# EAGLE design WMF Ambient SmartPot_C (EAGLE 9.5.1)
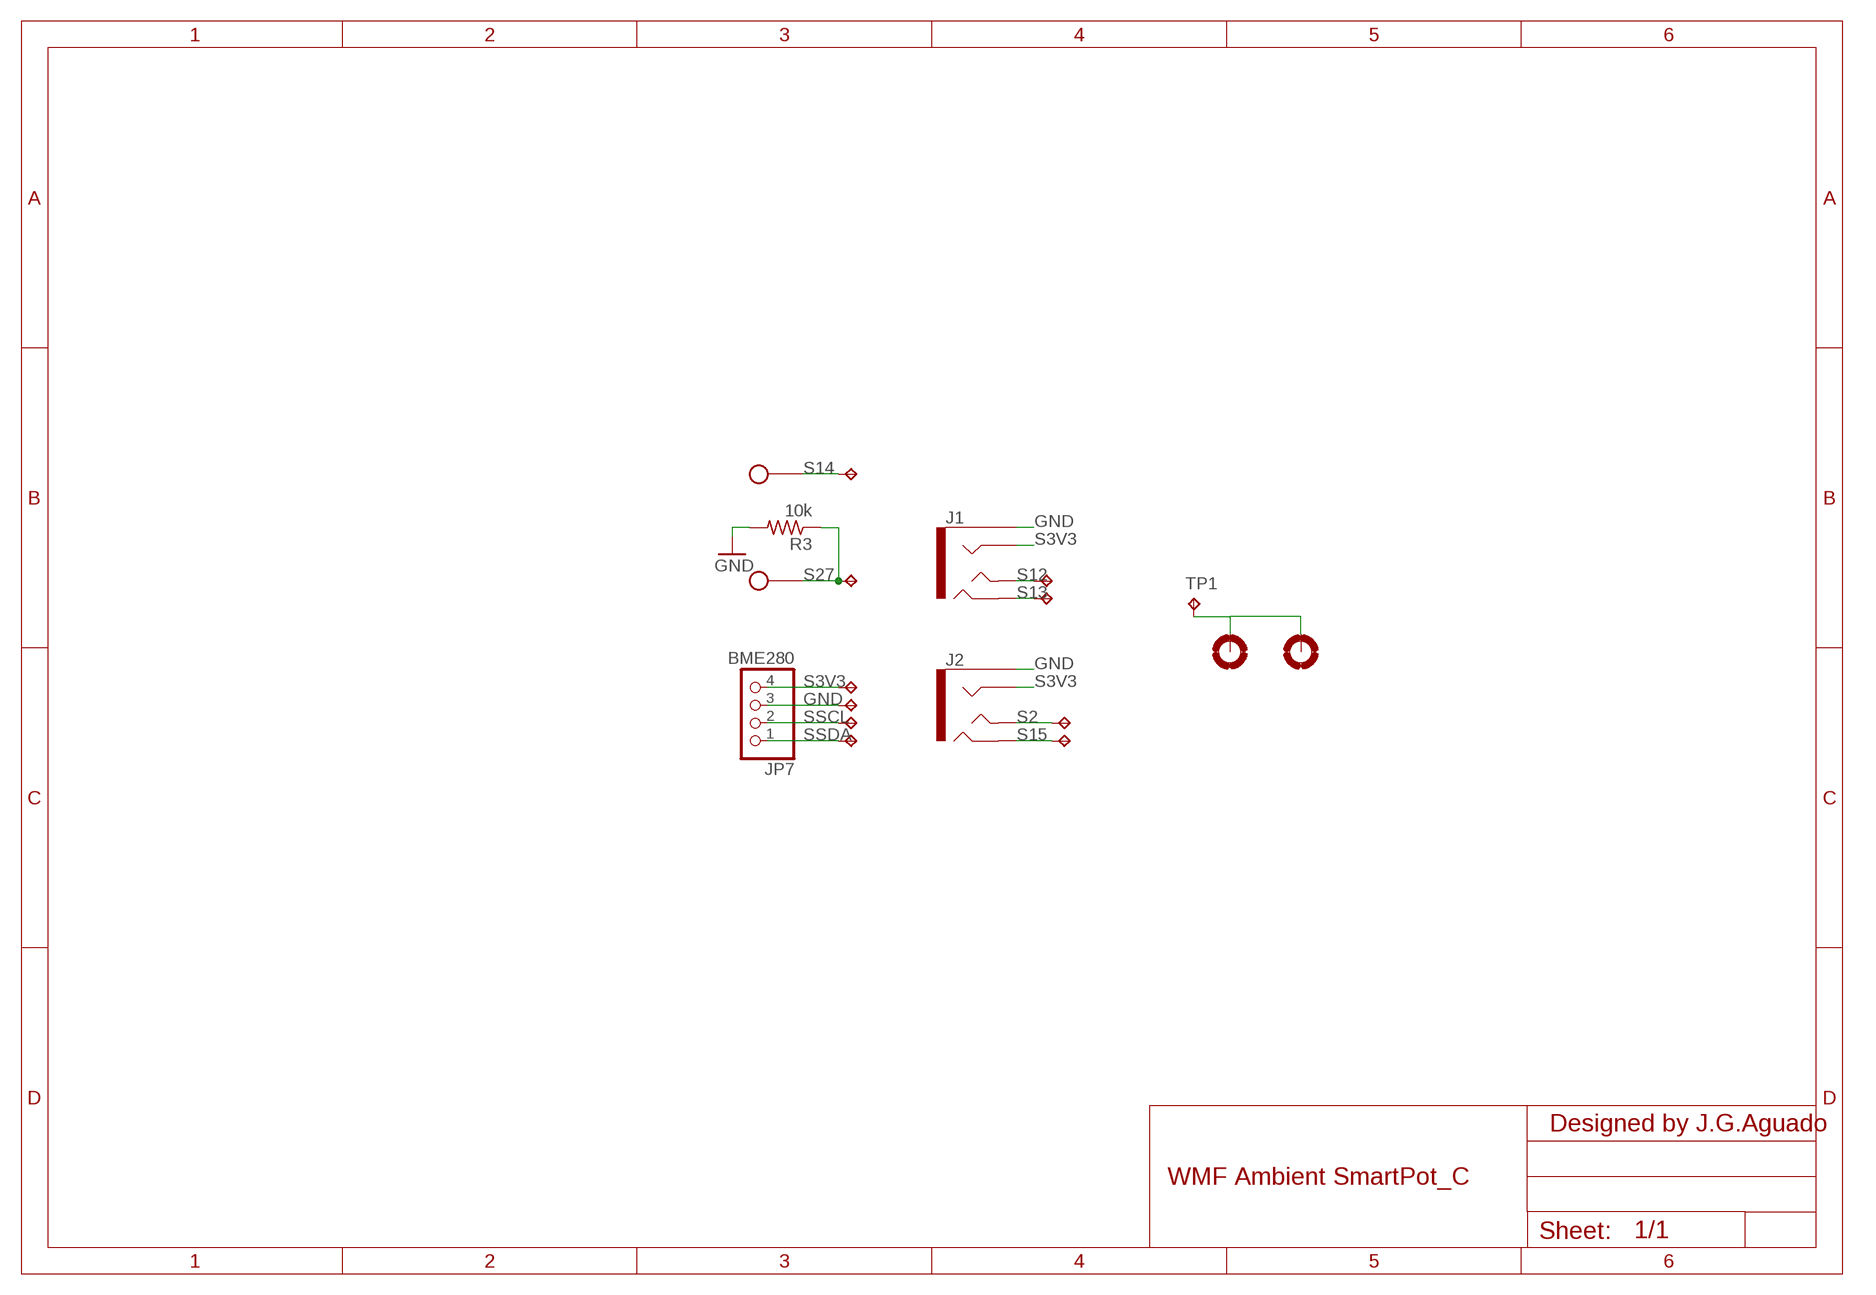
[diagram p0: schematic, sheet 1]

## Parts
H1  MOUNT-PAD-ROUND2.8  [2,8-PAD]
H2  MOUNT-PAD-ROUND2.8  [2,8-PAD]
J1  AUDIO_JACK_TRRSSMD_RA  [AUDIO_JACK_3.5MM_TRRS_SMD_RA]
J2  AUDIO_JACK_TRRSSMD_RA  [AUDIO_JACK_3.5MM_TRRS_SMD_RA]
JP7  BME280  PINHD-1X4  [1X04]
R3  10k  R1206  [1206]
TP1  TPTP15SQ  [TP15SQ]
TP6  TPTP15SQ  [TP15SQ]
TP7  TPTP15SQ  [TP15SQ]
TP8  TPTP15SQ  [TP15SQ]
TP9  TPTP15SQ  [TP15SQ]
TP12  TPTP15SQ  [TP15SQ]
TP16  TPTP15SQ  [TP15SQ]
TP17  TPTP15SQ  [TP15SQ]
TP20  TPTP15SQ  [TP15SQ]
TP21  TPTP15SQ  [TP15SQ]
TP23  TPTP15SQ  [TP15SQ]
U$2  OVAL_3MM_HOLE  [OVAL_HOLE]
U$3  OVAL_3MM_HOLE  [OVAL_HOLE]

## Nets
GND: J1.EARTH J2.EARTH JP7.3 R3.2 TP7.TP
S2: J2.TIP TP20.TP
S3V3: J1.RING1 J2.RING1 JP7.4 TP6.TP
S12: J1.TIP TP16.TP
S13: J1.RING2 TP17.TP
S14: TP12.TP U$2.P$2
S15: J2.RING2 TP21.TP
S27: R3.1 TP23.TP U$3.P$2
SSCL: JP7.2 TP8.TP
SSDA: JP7.1 TP9.TP
TOUCH: H1.B2,8(MOUNT) H2.B2,8(MOUNT) TP1.TP

## Notes on the sheet
- Designed by J.G.Aguado

## Library data of the parts
H1 H2 = holes:MOUNT-PAD-ROUND: MOUNTING PAD, round
J1 J2 = SparkFun-Connectors:AUDIO_JACK_TRRS: Audio Jack - 3.5mm TRRS (SMD) This is a 3.5mm TRRS SMD audio jack. TRRS connectors are the audio-style connectors that you see on some phones, MP3 players and development boards. TRRS stands for “tip, ring, ring, sleeve,” which reflects that this has three conductors and a ground. SparkFun Products: Audio Jack <https://www.sparkfun.com/products/12639> mbed Starter Kit <https://www.sparkfun.com/products/12968> SparkFun TRRS 3.5mm Jack Breakout <https://www.sparkfun.com/products/11570>; PROD_ID: CONN-10676; SF_ID: PRT-12639
JP7 = SpaceDIY_connectors:PINHD-1X4: PIN HEADER
R3 = SpaceDIY_passive_components:R1206
TP1 TP6-TP9 TP12 TP16 TP17 TP20 TP21 TP23 = testpad:TP: Test pad
U$2 U$3 = SpaceDIY_connectors:OVAL_3MM_HOLE

## Board
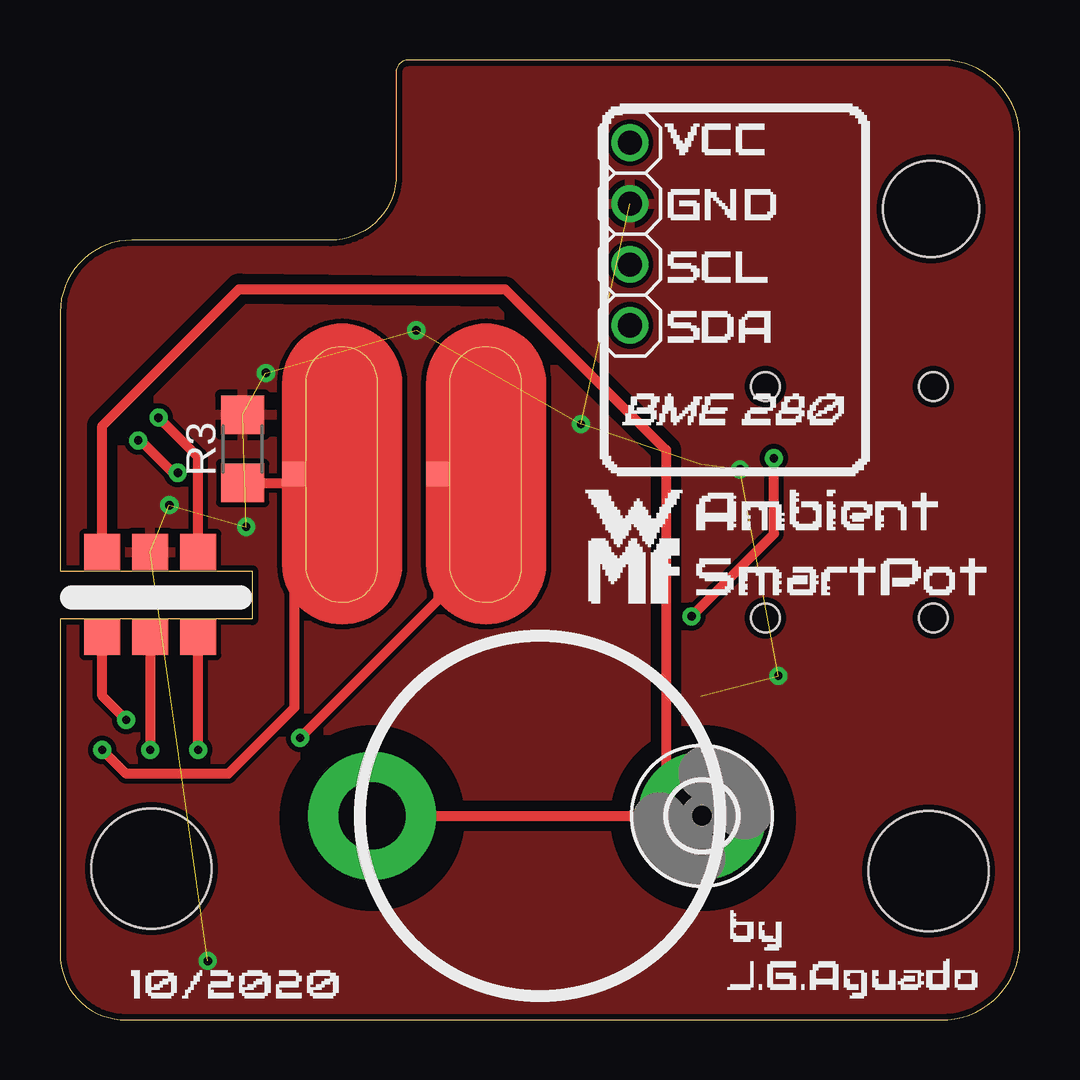
[diagram p1: board, top side]
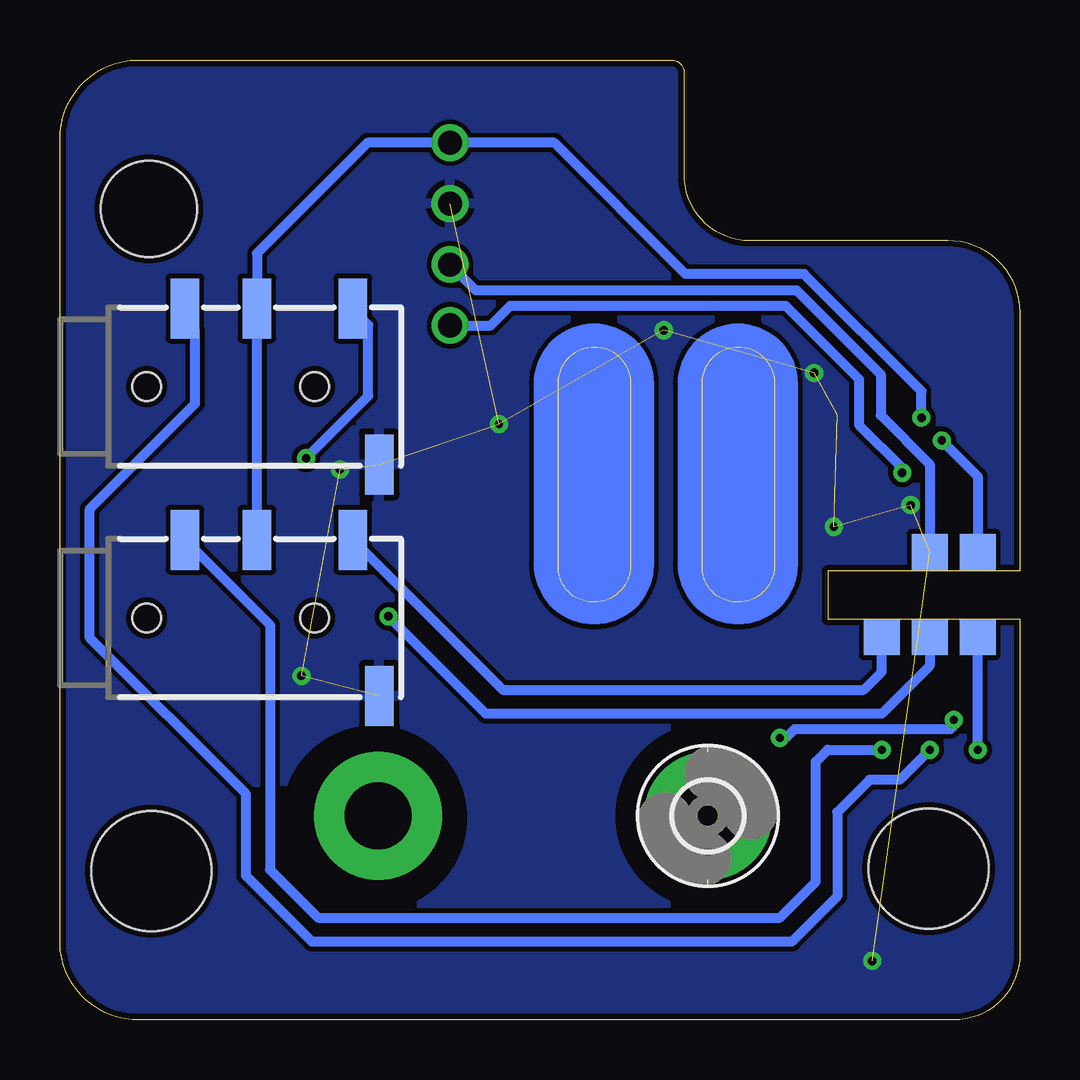
[diagram p2: board, bottom side, seen from below]

Size 40.02 x 40.01 mm. Coordinates in mm from the lower left corner, seen from the top.
Outline: 2.51,0 37.01,0 arc90 40.01,3.5 40.01,37 arc90 36.51,40 14.51,40 arc90 14.01,39.5 14.01,35 arc-90 11.01,32.5 3.01,32.5 arc90 0.01,29.5 0.01,18.7 8.01,18.7 8.01,16.7 0.01,16.7 0.01,3 arc90 2.51,0
Copper layers (1*16): Top 0.035mm / dielectric 1.5mm / Bottom 0.035mm
Design rules "PCBway *": minimum track width 6mil, minimum drill 0.3mm, track to track 0.205mm, track to pad 0.205mm, pad to pad 0.205mm, via to via 0.205mm, smd to smd 8mil, copper to edge 10mil, drill to drill 8mil, minimum pad ring 10mil, minimum via ring 8mil, stop-mask expansion 4mil, vias tented up to drill 25mil, thermal gap 10mil
Holes 5 mm at 3.81,6.3 36.21,6.2
Holes 4 mm at 36.31,33.8
tRestrict: area 23,4.6 to 30.6,12.2; area 9.2,4.6 to 16.8,12.2; 7 lines
bRestrict: area 9.2,4.7 to 16.8,12.3; area 23.1,4.6 to 30.7,12.2

### Footprints (pad centres in the part's own frame; a part is rotated, then mirrored left to right if it is on the bottom)
2,8-PAD = drill 2.8 pad 5.334: B2,8 0,0
AUDIO_JACK_3.5MM_TRRS_SMD_RA = smd 1.2 x 2.5: EARTH 11.3,-3.25; RING1 6.2,3.25; RING2 3.2,3.25; TIP 10.2,3.25 | hole 1.2: 1.6,0; 8.6,0
1X04 = drill 1.016: 1 -3.81,0; 2 -1.27,0; 3 1.27,0; 4 3.81,0
1206 = smd 1.6 x 1.803: 1 -1.422,0; 2 1.422,0
TP15SQ = smd 1.5 x 1.5: TP 0,0
OVAL_HOLE = smd 1 x 1: P$2 -2,0

### Placement (x,y rotation side)
H1  13.01,8.5 180 bottom
H2  26.76,8.5 180 top
J1  38.01,26.39 0 bottom
J2  38.01,16.75 0 bottom
JP7  23.76,32.75 90 top
R3  7.61,23.8 90 top
TP1  1.76,19.5 90 top
TP6  5.76,19.5 90 top
TP7  3.76,19.5 90 top
TP8  3.76,19.5 90 bottom
TP9  1.76,19.5 90 bottom
TP12  1.76,15.95 0 top
TP16  3.76,15.95 0 bottom
TP17  3.76,15.95 0 top
TP20  5.76,15.95 0 bottom
TP21  5.76,15.95 0 top
TP23  1.76,15.95 0 bottom
U$2  17.76,22.75 0 top
U$3  11.76,22.75 0 top

### Tracks (layer width: path | path; a pad name or v marks a point on that pad's centre or on a via)
GND  (via drill 0.35)  (12 unrouted)
  other vias: 4.56,21.45 6.16,2.45 7.76,20.55 8.58,26.96 14.85,28.74 21.72,24.83 28.35,22.94 29.95,14.34
  pour Top: 0.01,32.45 11.61,32.45 arc90 14.06,34.9 14.06,40 40.26,40 40.26,-0.25 0.01,-0.25
  pour Bottom: 40.26,39.9 14.06,39.9 14.06,35 arc-90 11.41,32.35 0.01,32.35 0.01,-0.25 40.26,-0.25
S2
  Bottom 0.406: J2.TIP 21.56,13.75 6.51,13.75 5.76,14.5 TP20.TP
S3V3  (via drill 0.35)
  Top 0.406: TP6.TP 5.76,23.45 v4.11,25.1
  Bottom 0.406: v4.11,25.1 4.11,26.2 9,31.09 13.94,31.09 19.41,36.56 JP7.4 27.2,36.56 31.81,31.95 J1.RING1 J2.RING1
S12  (via drill 0.35)
  Top 0.406: v26.33,16.82 29.76,20.25 v29.76,23.41
  Bottom 0.406: TP16.TP 3.76,14.75 5.76,12.75 22.26,12.75 v26.33,16.82 | v29.76,23.41 27.17,26 27.17,28.96 27.81,29.6 J1.TIP
S13  (via drill 0.35)
  Top 0.406: TP17.TP v3.76,11.25
  Bottom 0.406: v3.76,11.25 5.01,10 6.26,10 7.62,8.64 7.62,5.14 9.51,3.25 29.51,3.25 32.26,6 32.26,9.41 38.77,15.92 38.77,21.29 34.39,25.68 34.39,28.75 34.81,29.17 J1.RING2
S14  (via drill 0.35)
  Top 0.406: U$2.P$2 15.76,17.5 v10.01,11.75 | v2.76,12.5 1.76,13.5 TP12.TP
  Bottom 0.406: v10.01,11.75 9.76,11.75 9.39,12.12 2.89,12.12 2.76,12.25 v2.76,12.5
S15  (via drill 0.35)
  Top 0.406: v5.76,11.25 TP21.TP
  Bottom 0.406: J2.RING2 31.26,16.45 31.26,6.25 29.26,4.25 10.01,4.25 8.51,5.75 8.51,10.75 8.01,11.25 v5.76,11.25
S27  (via drill 0.35)
  Top 0.406: U$3.P$2 9.76,22.3 | 9.76,22.3 9.76,13 7.01,10.25 2.76,10.25 v1.76,11.25 | R3.1 9.68,22.38 9.76,22.3
  Bottom 0.406: v1.76,11.25 TP23.TP
SSCL
  Bottom 0.406: JP7.2 22.69,30.41 9.32,30.41 5.81,26.9 5.81,25.2 3.76,23.15 TP8.TP
SSDA  (via drill 0.35)
  Top 0.406: v4.91,22.8 4.71,22.8 3.31,24.2 v3.26,24.15
  Bottom 0.406: JP7.1 22.07,28.94 21.25,29.76 9.77,29.76 6.71,26.7 6.71,24.8 4.91,23 v4.91,22.8 | v3.26,24.15 1.76,22.65 TP9.TP
TOUCH
  Top 0.406: TP1.TP 1.76,24.75 7.47,30.45 18.56,30.45 25.26,23.75 25.26,10 H2.B2,8 H1.B2,8